# EAGLE design Reflowduino32 v1 (EAGLE 8.7.0)
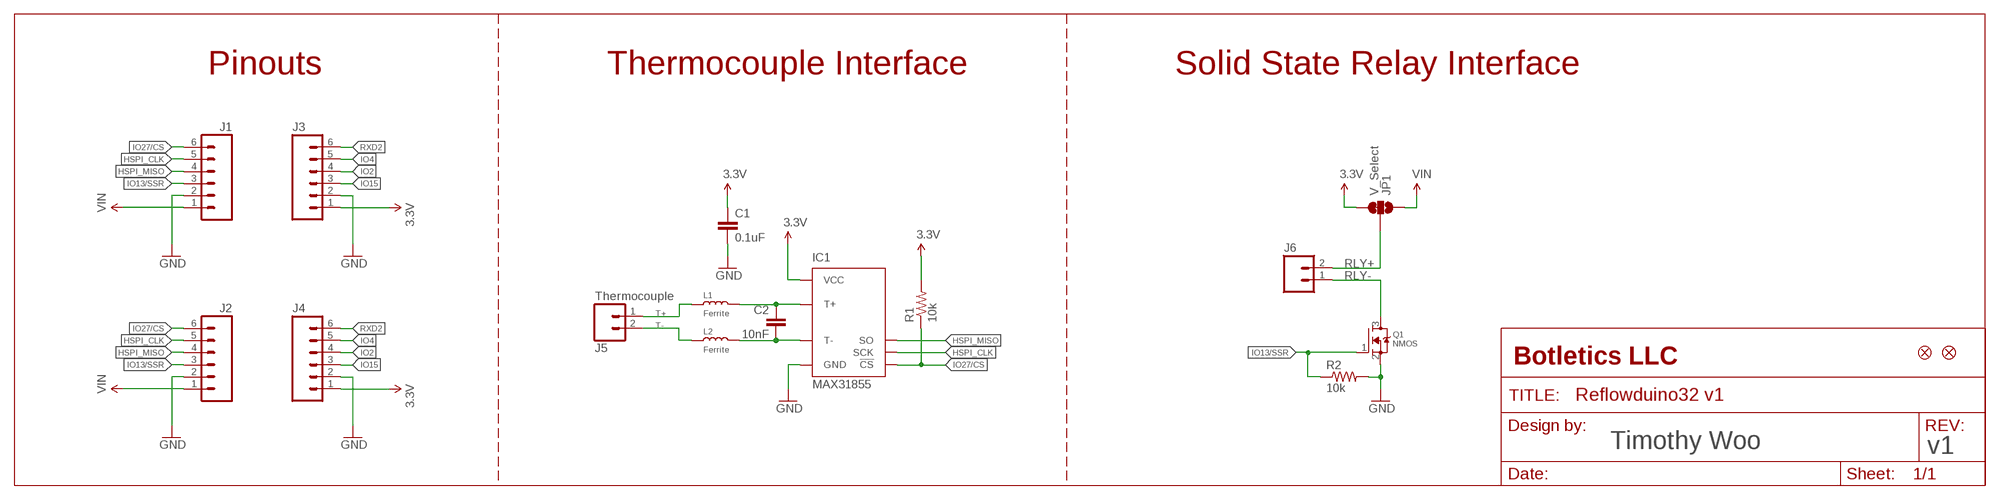
[diagram p0: schematic, sheet 1]

## Parts
C1  0.1uF  CAPMARKED-0603  [0603-CAP-MARKED]
C2  10nF  CAPMARKED-0603  [0603-CAP-MARKED]
FID1  FIDUCIAL  [FIDUCIAL_1MM]
FID2  FIDUCIAL  [FIDUCIAL_1MM]
IC1  MAX31855  [MAX31855_SOIC8]
J1  M06SILK_PTH  [1X06]
J2  M06NO_SILK_FEMALE_PTH  [1X06_NO_SILK]
J3  M06SILK_PTH  [1X06]
J4  M06NO_SILK_FEMALE_PTH  [1X06_NO_SILK]
J5  Thermocouple  M023.5MM  [SCREWTERMINAL-3.5MM-2]
J6  M023.5MM  [SCREWTERMINAL-3.5MM-2]
JP1  V_Select  JUMPER-SMT_3_1-NC_TRACE_SILK  [SMT-JUMPER_3_1-NC_TRACE_SILK]
L1  Ferrite  SMD-FERRITE-BEAD-2500R-50MA(0603)  [L0603]
L2  Ferrite  SMD-FERRITE-BEAD-2500R-50MA(0603)  [L0603]
Q1  NMOS  MOSFET-NGENERIC  [SOT23-3]
R1  10k  RESISTORMARKED-0603  [0603-RES-MARKED]
R2  10k  RESISTORMARKED-0603  [0603-RES-MARKED]

## Nets
3.3V: C1.1 IC1.4(VCC) J3.1 J4.1 JP1.3 R1.2
GND [power]: C1.2 IC1.1(GND) J1.2 J2.2 J3.2 J4.2 Q1.2(S) R2.2
HSPI_CLK: IC1.5(SCK) J1.5 J2.5
HSPI_MISO: IC1.7(SO) J1.4 J2.4
IO2: J3.4 J4.4
IO4: J3.5 J4.5
IO13/SSR: J1.3 J2.3 Q1.1(G) R2.1
IO15: J3.3 J4.3
IO27/CS: IC1.6(!CS) J1.6 J2.6 R1.1
N$7: C2.2 IC1.2(T-) L2.2
N$8: C2.1 IC1.3(T+) L1.2
RLY+: J6.2 JP1.2
RLY-: J6.1 Q1.3(D)
RXD2: J3.6 J4.6
T+: J5.1 L1.1
T-: J5.2 L2.1
VIN: J1.1 J2.1 JP1.1

## Notes on the sheet
- Pinouts | Thermocouple Interface | Solid State Relay Interface
- Timothy Woo | v1

## Library data of the parts
C1 C2 = TimWoo-Capacitors:CAP: Capacitor Standard 0603 ceramic capacitor, and 0.1" leaded capacitor.
FID1 FID2 = TimWoo-Aesthetics:FIDUCIAL: Fiducial Alignment Points Various fiducial points for machine vision alignment.
IC1 = TimWoo-IC:MAX31855
J1-J4 = TimWoo-Connectors:M06: Header 6 Standard 6-pin 0.1" header. Use with straight break away headers (SKU : PRT-00116), right angle break away headers (PRT-00553), swiss pins (PRT-00743), machine pins (PRT-00117), and female headers (PRT-00115). Molex polarized connector foot print use with SKU : PRT-08094 with associated crimp pins and housings. NOTES ON THE VARIANTS LOCK and LOCK_LONGPADS... This footprint was designed to help hold the alignment of a through-hole component (i.e. 6-pin header) while soldering it into place. You may notice that each hole has been shifted either up or down by 0.005 of an inch from it's more standard position (which is a perfectly straight line). This slight alteration caused the pins (the squares in the middle) to touch the edges of the holes. Because they are alternating, it causes a "brace" to hold the component in place. 0.005 has proven to be the perfect amount of "off-center" position when using our standard breakaway headers. Although looks a little odd when you look at the bare footprint, once you have a header in there, the alteration is very hard to notice. Also,if you push a header all the way into place, it is covered up entirely on the bottom side. This idea of altering the position of holes to aid alignment will be further integrated into the Sparkfun Library for other footprints. It can help hold any component with 3 or more connection pins.; PROD_ID: CONN-08437
J5 J6 = TimWoo-Connectors:M02: Standard 2-pin 0.1" header. Use with - straight break away headers ( PRT-00116) - right angle break away headers (PRT-00553) - swiss pins (PRT-00743) - machine pins (PRT-00117) - female headers (PRT-00115) Molex polarized connector foot print use with: PRT-08233 with associated crimp pins and housings. 2.54_SCREWTERM for use with PRT-10571. 3.5mm Screw Terminal footprints for PRT-08084 5mm Screw Terminal footprints for use with PRT-08432; PROD_ID: CONN-08399
JP1 = TimWoo-Connectors:JUMPER-SMT_3_1-NC_TRACE: Normally closed trace jumper (1 of 2 connections) This jumper has a trace between two pads so it's normally closed (NC). The other connection is normally open (NO). Use a razor knife to open the connection. For best results follow the IPC guidelines for cutting traces: Cutout at least 0.063 mm (0.005 in). Remove all loose material to clean up the cut area. Seal the cut with an approved epoxy. Reapply solder to reclose the connection, or to close the NO connection.
L1 L2 = TimWoo-Inductors:SMD-FERRITE-BEAD-2500R-50MA(0603): 303030020; VALUE: 2500R-50MA
Q1 = TimWoo-MOSFETs:MOSFET-N: N-Channel Mosfet DMG2302UK - 20V 2.8A SOT23 [Digikey: DMG2302UK-7DICT-ND] 2N7002E - 60V 260mA SOT23 [Digikey: 2N7002ET1GOSTR-ND] - REEL BSH103 - 30V 850mA SOT23 [Digikey: 568-5013-1-ND]
R1 R2 = TimWoo-Resistors:RESISTOR: Resistor Basic schematic elements and footprints for 0603, 1206, and PTH resistors.

## Net classes
0 default: width 0.305 mm
1 power: width 0.406 mm

## Board
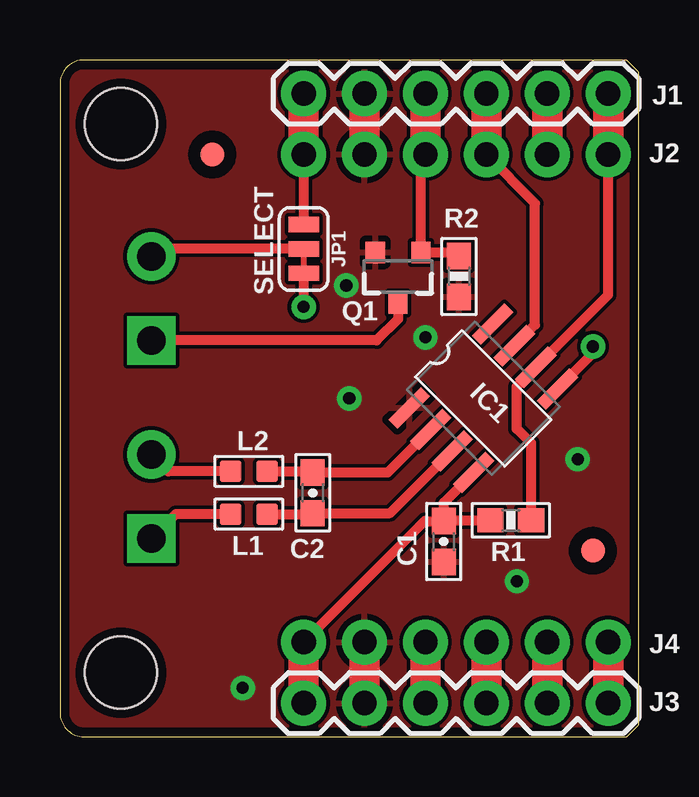
[diagram p1: board, top side]
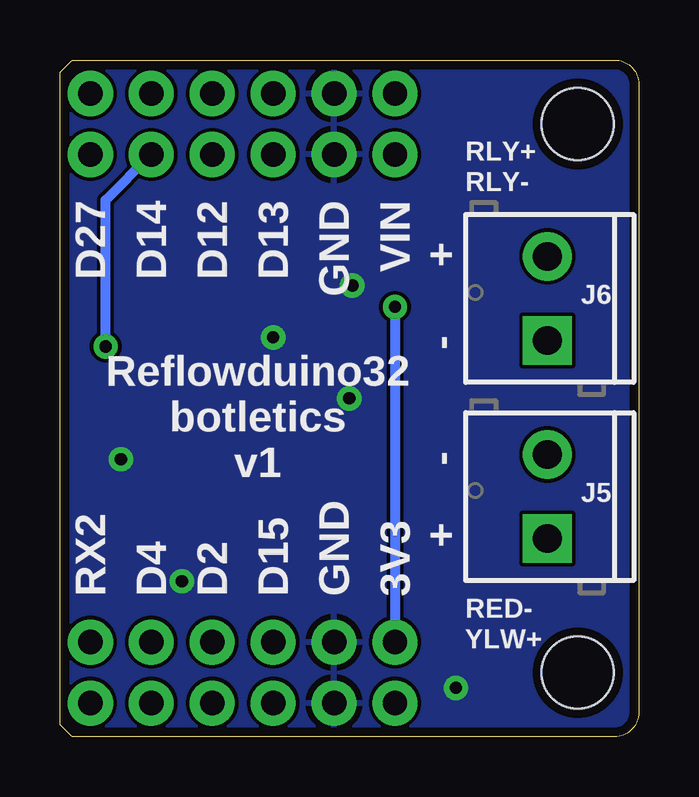
[diagram p2: board, bottom side, seen from below]

Size 24.13 x 28.19 mm. Coordinates in mm from the lower left corner, seen from the top.
Outline: 1,0 23.63,0 24.13,0.5 24.13,27.69 23.63,28.19 1,28.19 arc90 0,27.19 0,1 arc90 1,0
Copper layers (1*16): Top 0.0356mm / dielectric 1.5011mm / Bottom 0.0356mm
Design rules "oshpark-2layer *": minimum track width 6mil, minimum drill 13mil, track to track 6mil, track to pad 6mil, pad to pad 6mil, via to via 6mil, smd to smd 6mil, copper to edge 15mil, drill to drill 6mil, minimum pad ring 7mil, minimum via ring 7mil, stop-mask expansion 2.5mil, vias tented up to drill 20mil, thermal gap 10mil
Holes 3 mm at 2.54,2.67 2.54,25.53

### Footprints (pad centres in the part's own frame; a part is rotated, then mirrored left to right if it is on the bottom)
0603-CAP-MARKED = smd 1.1 x 1: 1 -0.85,0; 2 0.85,0
FIDUCIAL_1MM = smd 1 x 1: 1 0,0
MAX31855_SOIC8 = smd 0.53 x 1.92: 1 -1.905,-2.465; 2 -0.635,-2.465; 3 0.635,-2.465; 4 1.905,-2.465; 5 1.905,2.465; 6 0.635,2.465; 7 -0.635,2.465; 8 -1.905,2.465
1X06 = drill 1.016 pad 1.88: 1 -6.35,0; 2 -3.81,0; 3 -1.27,0; 4 1.27,0; 5 3.81,0; 6 6.35,0
1X06_NO_SILK = drill 1.016 pad 1.88: 1 -6.35,0; 2 -3.81,0; 3 -1.27,0; 4 1.27,0; 5 3.81,0; 6 6.35,0
SCREWTERMINAL-3.5MM-2 = drill 1.2 pad 2.032 square: 1 0,0 | drill 1.2 pad 2.032: 2 3.5,0
SMT-JUMPER_3_1-NC_TRACE_SILK = smd 0.635 x 1.27: 1 -1.016,0; 2 0,0; 3 1.016,0
L0603 = smd 0.889 x 0.889: 1 -0.762,0; 2 0.762,0
SOT23-3 = smd 0.8 x 0.9: 1 -0.95,-1; 2 0.95,-1; 3 0,1.1
0603-RES-MARKED = smd 1.1 x 1: 1 -0.85,0; 2 0.85,0

### Placement (x,y rotation side)
C1  16,8.13 270 top
C2  10.54,10.16 90 top
FID1  6.35,24.26 0 top
FID2  22.23,7.75 0 top
IC1  17.65,14.1 315 top
J1  16.51,26.8 0 top
J2  16.51,24.26 0 top
J3  16.51,1.4 0 top
J4  16.51,3.94 0 top
J5  3.81,8.26 90 bottom
J6  3.81,16.51 90 bottom
JP1  10.16,20.32 270 top
L1  7.87,9.27 0 top
L2  7.87,11.05 0 top
Q1  14.1,19.18 180 top
R1  18.8,9.02 180 top
R2  16.64,19.18 270 top

### Tracks (layer width: path | path; a pad name or v marks a point on that pad's centre or on a via)
3.3V  (via drill 0.51 pad 1.02)
  Top 0.406: J4.1 15.2,8.98 C1.1 | C1.1 16,9.75 IC1.4 | C1.1 16.04,9.02 R1.2 | JP1.3 v10.16,17.91
  Top 1.27: J3.1 J4.1
  Bottom 0.406: v10.16,17.91 J4.1
GND  (via drill 0.51 pad 1.02)
  Top 1.27: J1.2 J2.2 | J3.2 J4.2
  other vias: 12.06,14.1 7.62,2.03 19.05,6.48 21.59,11.56 11.94,18.8 15.24,16.64
  pour Top: -1.27,29.34 25.4,29.34 25.4,-1.14 -1.27,-1.14
  pour Bottom: -2.54,30.61 26.67,30.61 26.67,-2.41 -2.54,-2.41
HSPI_CLK  (via drill 0.51 pad 1.02)
  Top 0.406: IC1.5 22.23,15.97 v22.23,16.26
  Top 1.27: J1.5 J2.5
  Bottom 0.406: v22.23,16.26 22.23,22.35 J2.5
HSPI_MISO
  Top 0.406: IC1.7 19.81,17.15 19.81,22.23 J2.4
  Top 1.27: J1.4 J2.4
IO2
  Top 1.27: J3.4 J4.4
IO4
  Top 1.27: J4.5 J3.5
IO13/SSR
  Top 0.406: J2.3 15.05,24.06 Q1.1 16.49,20.18 R2.1
  Top 1.27: J1.3 J2.3
IO15
  Top 1.27: J4.3 J3.3
IO27/CS
  Top 0.406: R1.1 19.65,12.23 19.05,12.83 19.05,14.6 IC1.6 22.86,18.41 J2.6
  Top 1.27: J1.6 J2.6
N$7
  Top 0.406: L2.2 10.5,11.05 C2.2 13.67,11.01 IC1.2
N$8
  Top 0.406: L1.2 10.5,9.27 C2.1 13.76,9.31 IC1.3
RLY+
  Top 0.406: JP1.2 4.12,20.32 J6.2
RLY-
  Top 0.406: Q1.3 14.1,17.4 13.21,16.51 J6.1
RXD2
  Top 1.27: J3.6 J4.6
T+
  Top 0.406: L1.1 4.83,9.27 J5.1
T-
  Top 0.406: L2.1 4.52,11.05 J5.2
VIN
  Top 0.406: J2.1 JP1.1
  Top 1.27: J1.1 J2.1

### Text on the board
tPlace: SELECT
bPlace: RLY+ | RLY- | VIN | GND | D13 | D12 | D14 | D27 | + | - | Reflowduino32 | botletics | - | v1 | + | 3V3 | GND | D15 | D2 | D4 | RX2 | RED- | YLW+